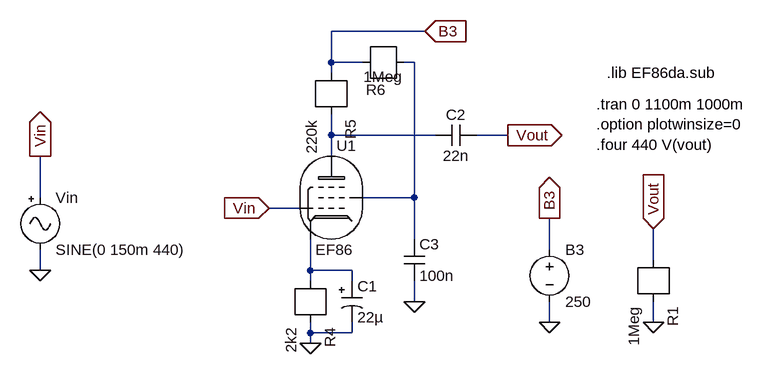
[diagram p0: schematic preamp.asc]
preamp.asc, the LTspice schematic file:
Version 4
SHEET 1 1244 680
WIRE 640 48 496 48
WIRE 496 96 496 48
WIRE 544 96 496 96
WIRE 624 96 608 96
WIRE 496 112 496 96
WIRE 496 208 496 176
WIRE 656 208 496 208
WIRE 768 208 720 208
WIRE 496 240 496 208
WIRE 48 304 48 240
WIRE 624 304 624 96
WIRE 624 304 544 304
WIRE 448 320 400 320
WIRE 624 368 624 304
WIRE 832 384 832 336
WIRE 992 400 992 352
WIRE 48 416 48 384
WIRE 464 416 464 368
WIRE 528 416 464 416
WIRE 464 432 464 416
WIRE 528 432 528 416
WIRE 624 464 624 432
WIRE 832 496 832 464
WIRE 992 496 992 464
WIRE 464 512 464 496
WIRE 528 512 528 496
WIRE 528 512 464 512
WIRE 464 528 464 512
FLAG 624 464 0
FLAG 48 416 0
FLAG 48 240 Vin
IOPIN 48 240 Out
FLAG 400 320 Vin
IOPIN 400 320 In
FLAG 464 528 0
FLAG 832 496 0
FLAG 832 336 B3
IOPIN 832 336 Out
FLAG 640 48 B3
IOPIN 640 48 In
FLAG 768 208 Vout
IOPIN 768 208 Out
FLAG 992 496 0
FLAG 992 352 Vout
IOPIN 992 352 In
SYMBOL voltage 832 368 R0
SYMATTR InstName B3
SYMATTR Value 250
SYMBOL EF86da 496 304 R0
SYMATTR InstName U1
SYMBOL signal 48 288 R0
SYMATTR InstName Vin
SYMATTR Value SINE(0 150m 440)
SYMATTR Value2 AC 150m
SYMBOL r 464 432 R90
SYMATTR InstName R4
SYMATTR Value 2k2
SYMBOL polcap 512 432 R0
SYMATTR InstName C1
SYMATTR Value 22µ
SYMBOL r 496 112 R90
SYMATTR InstName R5
SYMATTR Value 220k
SYMBOL r 544 96 R0
WINDOW 0 36 42 Right 2
WINDOW 3 62 22 Right 2
SYMATTR InstName R6
SYMATTR Value 1Meg
SYMBOL cap 720 192 R90
WINDOW 0 0 32 VBottom 2
WINDOW 3 32 32 VTop 2
SYMATTR InstName C2
SYMATTR Value 22n
SYMBOL cap 608 368 R0
SYMATTR InstName C3
SYMATTR Value 100n
SYMBOL r 992 400 R90
SYMATTR InstName R1
SYMATTR Value 1Meg
TEXT 920 112 Left 2 !.lib EF86da.sub
TEXT 904 160 Left 2 !.tran 0 1100m 1000m\n.option plotwinsize=0\n.four 440 V(vout)

The netlist it stands for:
* preamp.asc
V§B3 B3 0 250
XU1 N002 N001 Vin N003 EF86da  ; pins Anode Screen Grid Cathode
Vin Vin 0 SINE(0 150m 440) AC 150m
R4 0 N003 2k2
C1 N003 0 22µ
R5 N002 B3 220k
R6 N001 B3 1Meg
C2 Vout N002 22n
C3 N001 0 100n
R1 0 Vout 1Meg
.lib EF86da.sub
.tran 0 1100m 1000m
.option plotwinsize=0
.four 440 V(vout)
.lib EF86da.sub
.backanno
.end